# EAGLE design mixer (EAGLE 7.6.0)
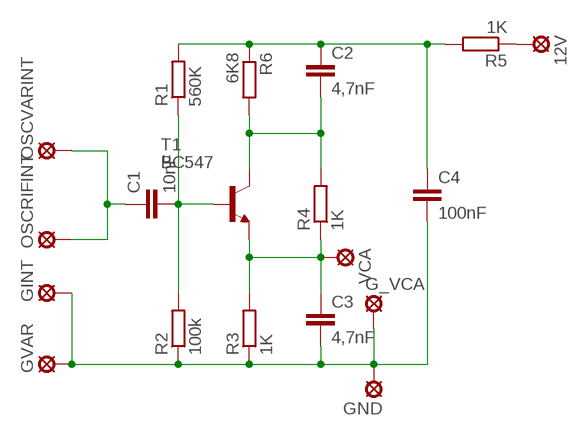
[diagram p0: schematic, sheet 1]

## Parts
12V  LSP10  [LSP10]
C1  10nF  C-EU050-025X075  [C050-025X075]
C2  4,7nF  C-EU050-025X075  [C050-025X075]
C3  4,7nF  C-EU050-025X075  [C050-025X075]
C4  100nF  C-EU050-025X075  [C050-025X075]
G_VCA  LSP10  [LSP10]
GINT  LSP10  [LSP10]
GND  LSP10  [LSP10]
GVAR  LSP10  [LSP10]
OSCRIFINT  LSP10  [LSP10]
OSCVARINT  LSP10  [LSP10]
R1  560K  R-EU_0207/12  [0207/12]
R2  100k  R-EU_0207/12  [0207/12]
R3  1K  R-EU_0207/12  [0207/12]
R4  1K  R-EU_0207/12  [0207/12]
R5  1K  R-EU_0207/12  [0207/12]
R6  6K8  R-EU_0207/12  [0207/12]
T1  BC547  [TO92]
VCA  LSP10  [LSP10]

## Nets
N$1: C1.2 R1.1 R2.2 T1.2(B)
N$2: C2.2 R4.2 R6.2 T1.3(C)
N$3: C3.1 R3.2 R4.1 T1.1(E) VCA.MP
N$6: C2.1 C4.1 R1.2 R5.2 R6.1
N$8: C1.1 OSCRIFINT.MP OSCVARINT.MP
N$9: 12V.MP R5.1
N$12: C3.2 C4.2 G_VCA.MP GINT.MP GND.MP GVAR.MP R2.1 R3.1

## Library data of the parts
12V G_VCA GINT GND GVAR OSCRIFINT OSCVARINT VCA = solpad:LSP10: SOLDER PAD drill 1.0 mm, distributor Buerklin, 12H555
C1-C4 = rcl:C-EU: CAPACITOR, European symbol
R1-R6 = resistor:R-EU_: RESISTOR, European symbol
T1 = transistor:BC547: NPN TRANSISTOR

## Board
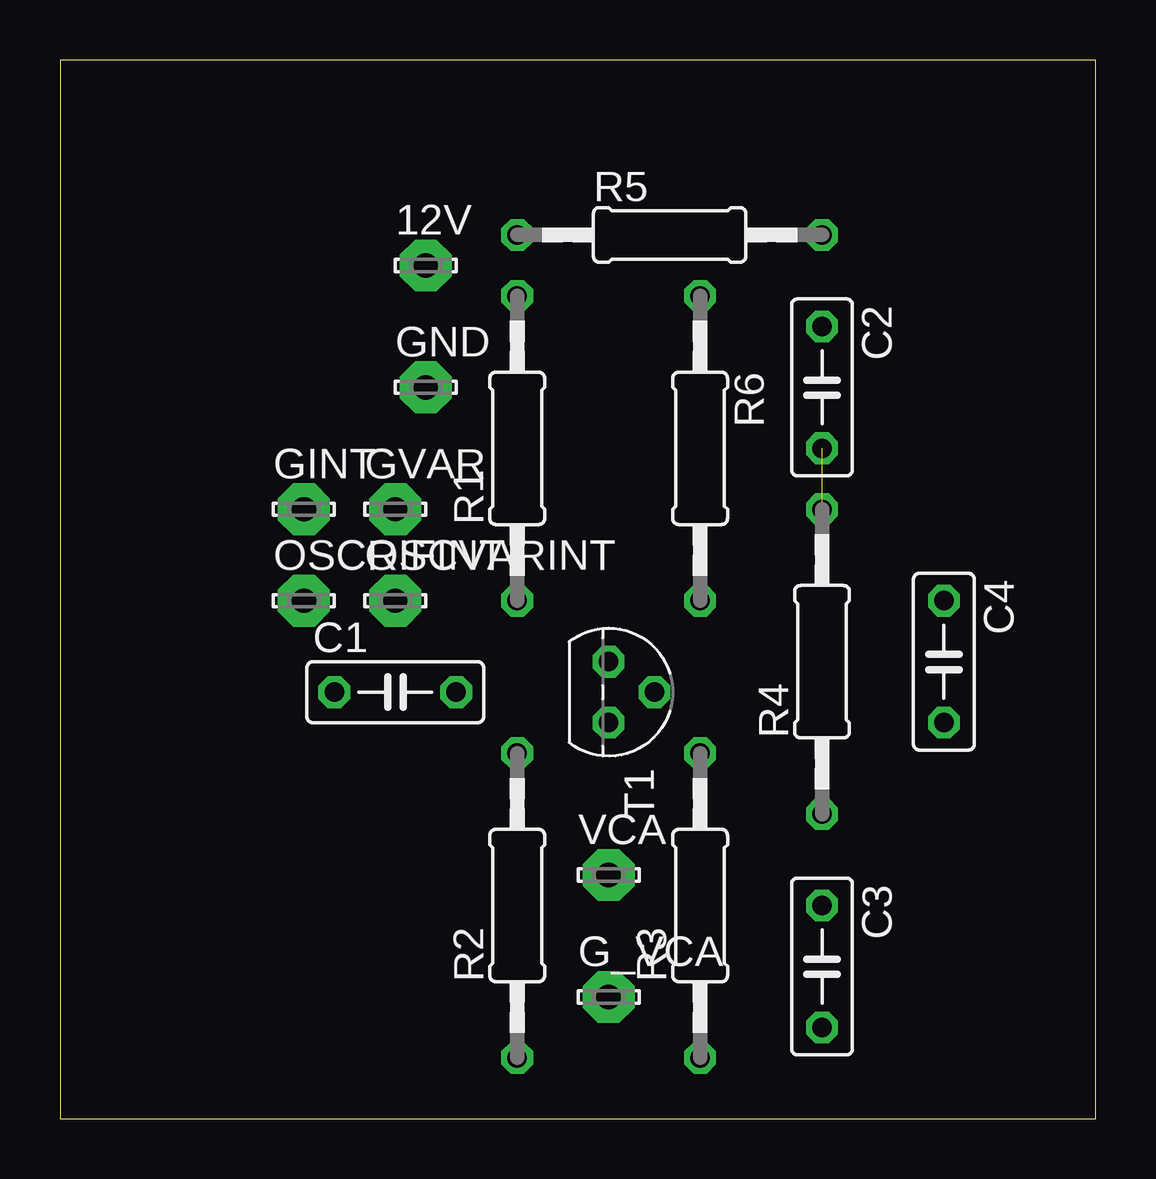
[diagram p1: board, top side]
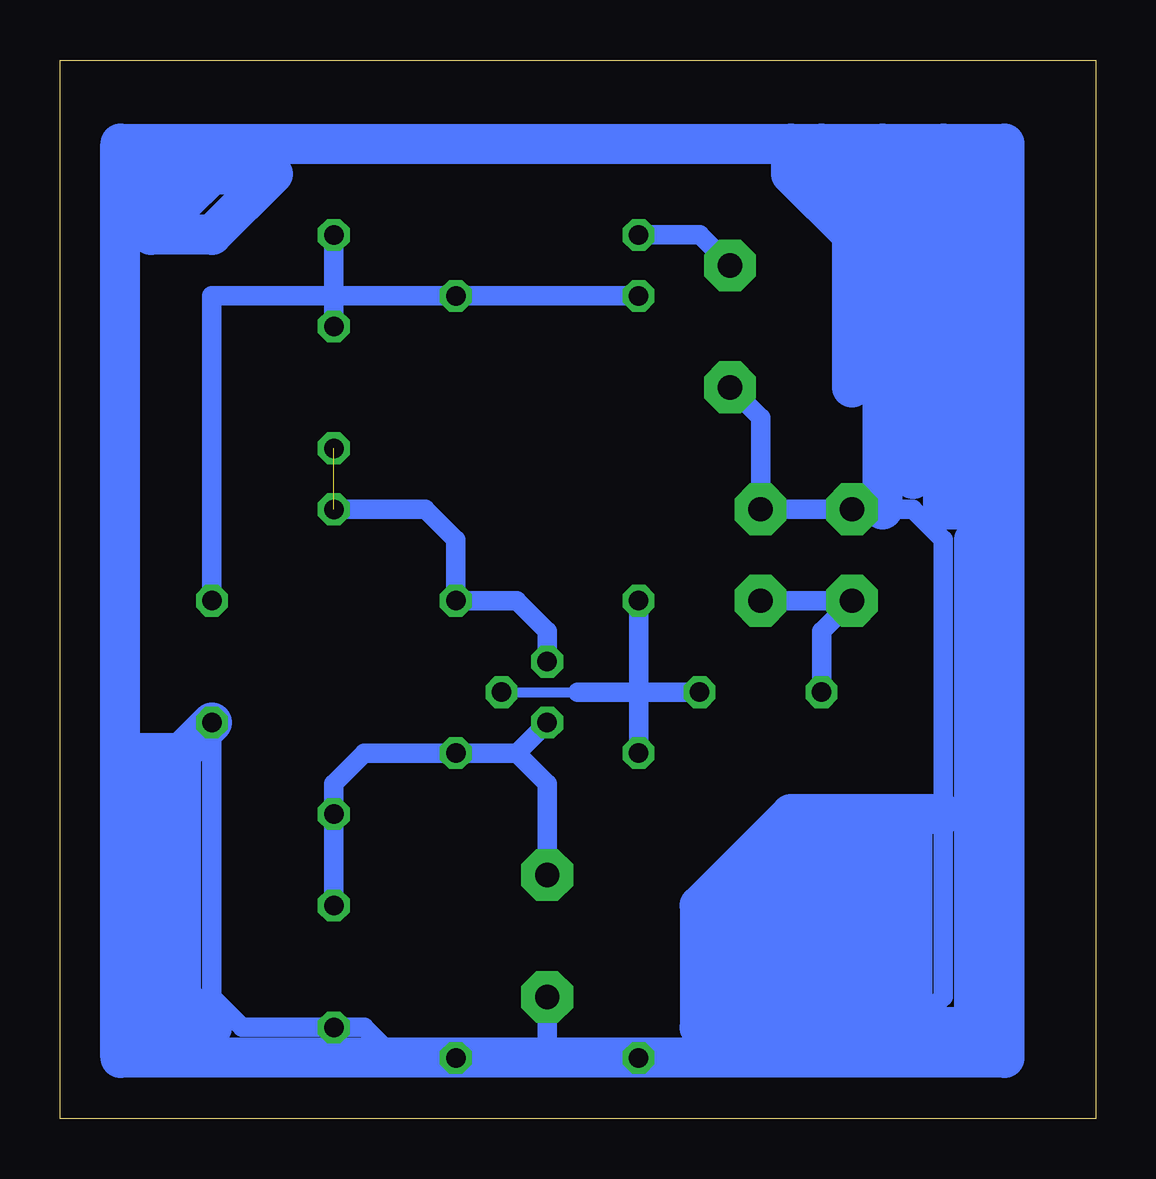
[diagram p2: board, bottom side, seen from below]

Size 43.16 x 44.12 mm. Coordinates in mm from the lower left corner, seen from the top.
Outline: 0,0 43.16,0 43.16,44.12 0,44.12 0,0
Copper layers (1*16): Top 0.035mm / dielectric 1.5mm / Bottom 0.035mm
Design rules "default": minimum track width 10mil, minimum drill 24mil, track to track 8mil, track to pad 8mil, pad to pad 8mil, via to via 8mil, smd to smd 8mil, copper to edge 40mil, drill to drill 8mil, minimum pad ring 10mil, minimum via ring 8mil, stop-mask expansion 4mil, vias tented up to drill 0mil, thermal gap 10mil

### Footprints (pad centres in the part's own frame; a part is rotated, then mirrored left to right if it is on the bottom)
LSP10 = drill 1.016 pad 2.159 octagon: MP 0,0
C050-025X075 = drill 0.813 octagon: 1 -2.54,0; 2 2.54,0
0207/12 = drill 0.813 octagon: 1 -6.35,0; 2 6.35,0
TO92 = drill 0.813 octagon: 1 1.27,0; 2 0,1.905; 3 -1.27,0

### Placement (x,y rotation side)
12V  15.24,35.56 0 top
C1  13.97,17.78 0 top
C2  31.75,30.48 270 top
C3  31.75,6.35 270 top
C4  36.83,19.05 270 top
G_VCA  22.86,5.08 0 top
GINT  10.16,25.4 0 top
GND  15.24,30.48 0 top
GVAR  13.97,25.4 0 top
OSCRIFINT  10.16,21.59 0 top
OSCVARINT  13.97,21.59 0 top
R1  19.05,27.94 90 top
R2  19.05,8.89 90 top
R3  26.67,8.89 90 top
R4  31.75,19.05 90 top
R5  25.4,36.83 0 top
R6  26.67,27.94 270 top
T1  22.86,17.78 270 top
VCA  22.86,10.16 0 top

### Tracks (layer width: path | path; a pad name or v marks a point on that pad's centre or on a via)
N$1
  Bottom 0.406: T1.2 21.59,17.78
  Bottom 0.813: R1.1 19.05,17.78 | C1.2 19.05,17.78 | 19.05,17.78 21.59,17.78 | R2.2 19.05,17.78
N$2  (1 unrouted)
  Bottom 0.813: R4.2 27.94,25.4 26.67,24.13 R6.2 24.13,21.59 22.86,20.32 T1.3
N$3
  Bottom 0.813: T1.1 24.13,15.24 | 24.13,15.24 R3.2 30.48,15.24 31.75,13.97 R4.1 C3.1 | VCA.MP 22.86,13.97 24.13,15.24
N$6
  Bottom 0.813: R5.2 31.75,34.29 | 31.75,34.29 C2.1 | R1.2 R6.1 31.75,34.29 | C4.1 36.83,34.29 31.75,34.29
N$8
  Bottom 0.813: C1.1 11.43,20.32 OSCRIFINT.MP OSCVARINT.MP
N$9
  Bottom 0.813: 12V.MP 16.51,36.83 R5.1
N$10
  Bottom 1.676: 5.08,24.13 5.08,3.81 6.35,3.81
N$12
  Bottom 0.813: 22.86,2.54 R2.1 8.89,2.54 7.62,3.81 6.35,5.08 6.35,12.7 6.35,24.13 7.62,25.4 8.89,25.4 GVAR.MP | 22.86,2.54 R3.1 29.21,2.54 30.48,3.81 C3.2 35.56,3.81 36.83,5.08 C4.2 | GND.MP 13.97,29.21 GVAR.MP | GVAR.MP GINT.MP | G_VCA.MP 22.86,2.54
  Bottom 1.676: 10.16,30.48 10.16,36.83 12.7,39.37 12.7,40.64 | 5.08,26.67 5.08,39.37 7.62,39.37 | 5.08,25.4 6.35,25.4 6.35,40.64 | 40.64,15.24 40.64,2.54 3.81,2.54 3.81,40.64 6.35,40.64 | 40.64,15.24 40.64,40.64 12.7,40.64 | 12.7,40.64 11.43,40.64 | 8.89,40.64 6.35,40.64 | 8.89,39.37 11.43,39.37 11.43,40.64 | 11.43,40.64 8.89,40.64 | 8.89,40.64 8.89,39.37 | 8.89,39.37 8.89,25.4 | 7.62,26.67 7.62,35.56 | 7.62,35.56 7.62,39.37 | 7.62,39.37 8.89,39.37 | 12.7,40.64 7.62,35.56 | C4.2 38.1,15.24 | 38.1,15.24 40.64,15.24 | 40.64,15.24 39.37,13.97 39.37,3.81 36.83,3.81 38.1,5.08 38.1,15.24 | 6.35,12.7 7.62,12.7 | 7.62,12.7 12.7,12.7 16.51,8.89 16.51,3.81 7.62,3.81 7.62,12.7 | 7.62,12.7 8.89,11.43 11.43,11.43 12.7,10.16 | 12.7,10.16 12.7,8.89 | 12.7,8.89 12.7,5.08 10.16,5.08 | 10.16,5.08 8.89,5.08 8.89,10.16 11.43,10.16 10.16,8.89 | 10.16,8.89 10.16,7.62 | 10.16,7.62 11.43,6.35 10.16,5.08 | 10.16,5.08 10.16,7.62 | 10.16,8.89 11.43,8.89 | 12.7,8.89 11.43,8.89 | 11.43,8.89 12.7,10.16 | 12.7,10.16 12.7,11.43 15.24,8.89 15.24,5.08 13.97,5.08 13.97,8.89 12.7,7.62 11.43,7.62
N$13
  Bottom 1.676: 34.29,39.37 36.83,36.83 39.37,36.83 39.37,39.37 36.83,39.37 | 38.1,38.1 36.83,39.37 | 36.83,39.37 35.56,39.37